# EAGLE design schematics (EAGLE 7.5.0)
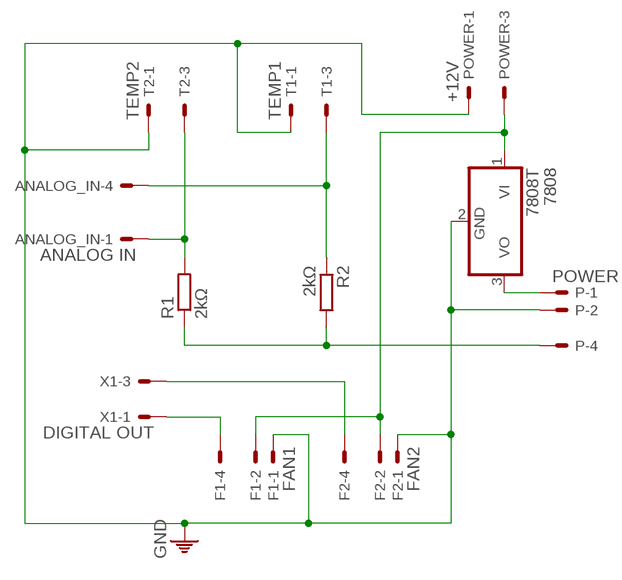
[diagram p0: schematic, sheet 1]

## Parts
7808  7808T  [TO220H]
ANALOG_IN  ANALOG IN  22-23-2041  [22-23-2041]
F1  FAN1  22-23-2041  [22-23-2041]
F2  FAN2  22-23-2041  [22-23-2041]
P  POWER  22-23-2041  [22-23-2041]
POWER  +12V  22-23-2031  [22-23-2031]
R1  2kΩ  R-EU_0411/15  [0411/15]
R2  2kΩ  R-EU_0411/15  [0411/15]
T1  TEMP1  22-23-2031  [22-23-2031]
T2  TEMP2  22-23-2031  [22-23-2031]
X1  DIGITAL OUT  22-23-2031  [22-23-2031]

## Nets
N$1: F1.4 X1.1
N$2: F2.4 X1.3
N$3: P.4 R1.1 R2.2
N$4: 7808.3(VO) P.1
N$6: 7808.1(VI) F1.2 F2.2 POWER.3
N$9: ANALOG_IN.4 R2.1 T1.3
N$10: ANALOG_IN.1 R1.2 T2.3
PE: 7808.2(GND) F1.1 F2.1 P.2 POWER.1 T1.1 T2.1 ; supply symbol labelled GND
Unconnected: ANALOG_IN.2 ANALOG_IN.3 F1.3 F2.3 P.3 POWER.2 T1.2 T2.2 X1.2

## Library data of the parts
7808 = linear:78*: Positive VOLTAGE REGULATOR Source: http://cache.national.com/ds/LM/LM78L05.pdf http://www.fairchildsemi.com/ds/LM/LM7805.pdf
ANALOG_IN F1 F2 P = con-molex:22-23-2041: .100" (2.54mm) Center Header - 4 Pin; MF: MOLEX; MPN: 22-23-2041; OC_FARNELL: 1462920; OC_NEWARK: 38C0355
POWER T1 T2 X1 = con-molex:22-23-2031: .100" (2.54mm) Center Header - 3 Pin; MF: MOLEX; MPN: 22-23-2031; OC_FARNELL: 1462950; OC_NEWARK: 30C0862
R1 R2 = resistor:R-EU_: RESISTOR, European symbol

## Board
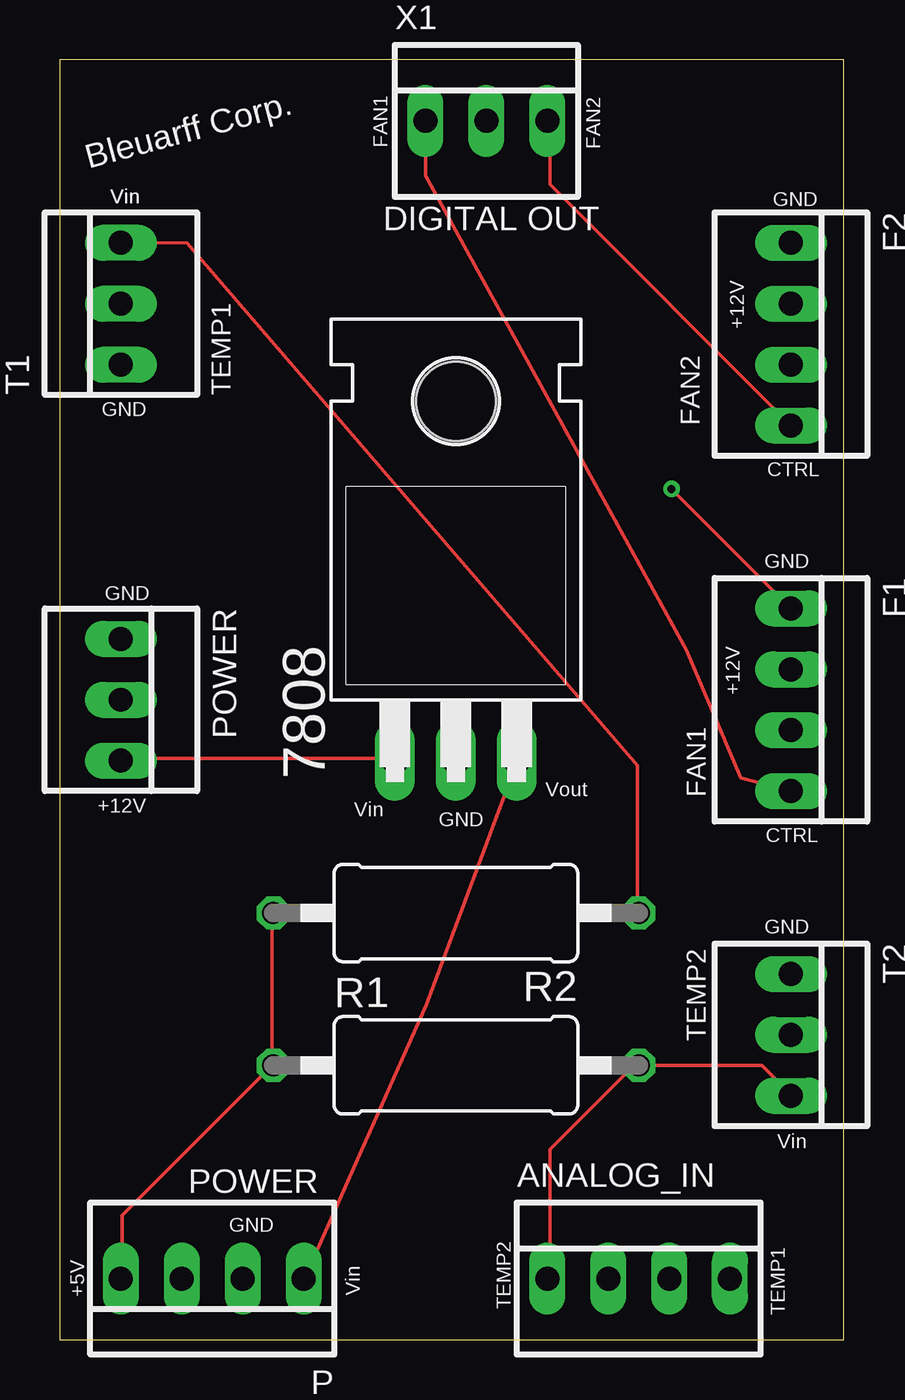
[diagram p1: board, top side]
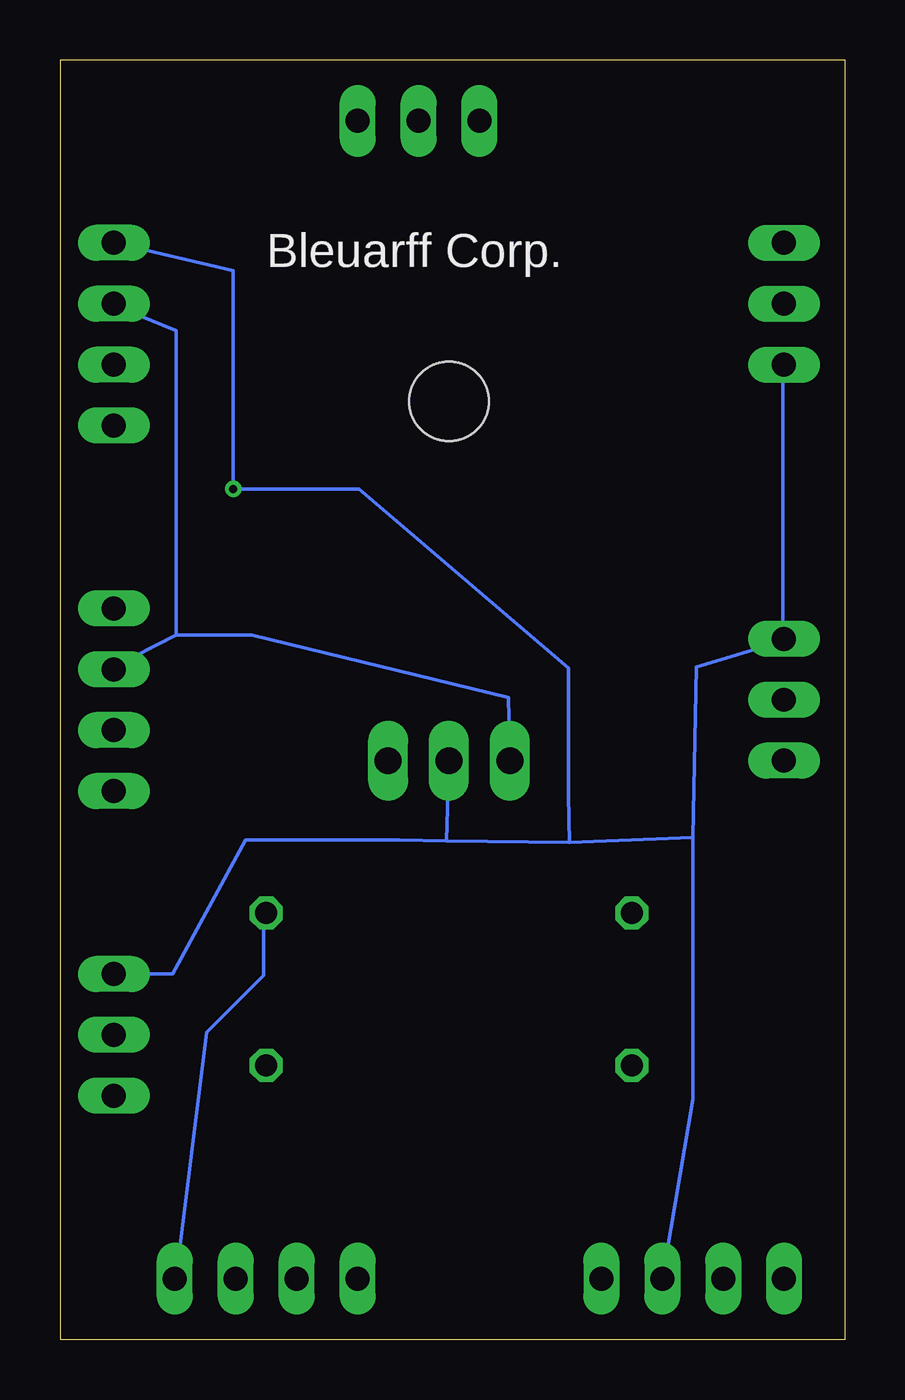
[diagram p2: board, bottom side, seen from below]

Size 32.69 x 53.34 mm. Coordinates in mm from the lower left corner, seen from the top.
Outline: 0,0 32.69,0 32.69,53.34 0,53.34 0,0
Copper layers (1*16): Top 0.0356mm / dielectric 1.5011mm / Bottom 0.0356mm
Design rules "LaenPCBOrder": minimum track width 6mil, minimum drill 13mil, track to track 6mil, track to pad 6mil, pad to pad 6mil, via to via 6mil, smd to smd 6mil, copper to edge 15mil, drill to drill 6mil, minimum pad ring 7mil, minimum via ring 7mil, stop-mask expansion 3mil, vias tented up to drill 0mil, thermal gap 10mil

### Footprints (pad centres in the part's own frame; a part is rotated, then mirrored left to right if it is on the bottom)
TO220H = drill 1.118 long: 1 -2.54,-10.16; 2 0,-10.16; 3 2.54,-10.16 | hole 3.302: 0,4.826
22-23-2041 = drill 1 long: 1 -3.81,0; 2 -1.27,0; 3 1.27,0; 4 3.81,0
22-23-2031 = drill 1 long: 1 -2.54,0; 2 0,0; 3 2.54,0
0411/15 = drill 0.914 octagon: 1 -7.62,0; 2 7.62,0

### Placement (x,y rotation side)
7808  16.51,34.29 0 top
ANALOG_IN  24.13,2.54 0 top
F1  30.48,26.67 270 top
F2  30.48,41.91 270 top
P  6.35,2.54 180 top
POWER  2.54,26.67 270 top
R1  16.51,11.43 0 top
R2  16.51,17.78 180 top
T1  2.54,43.18 90 top
T2  30.48,12.7 270 top
X1  17.78,50.8 0 top

### Tracks (layer width: path | path; a pad name or v marks a point on that pad's centre or on a via)
N$1
  Top 0.152: X1.1 15.24,48.51 26.11,28.75 28.4,23.42 F1.4
N$2
  Top 0.152: F2.4 20.42,48.16 20.42,50.75 X1.3
N$3
  Top 0.152: 8.84,11.43 8.84,17.68 R2.2 | 8.84,11.43 2.59,5.18 2.59,2.59 P.4 | 8.84,11.43 R1.1
N$4
  Top 0.152: P.1 10.21,2.59 15.29,13.97 19.05,24.08 7808.3
N$6
  Top 0.152: POWER.3 2.59,24.23 13.87,24.23 7808.1
  Bottom 0.152: 27.89,29.36 30.48,28.04 F1.2 | 27.89,29.36 27.89,42.06 30.48,43.13 F2.2 | 27.89,29.36 24.74,29.36 14.02,26.77 7808.1
N$9
  Top 0.152: T1.3 2.59,45.72 5.3,45.71 24.08,23.93 24.08,17.83 R2.1
  Bottom 0.152: R2.1 24.23,17.68 24.23,15.19 26.62,12.8 27.89,2.59 ANALOG_IN.4
N$10
  Top 0.152: T2.3 30.48,10.21 29.26,11.43 R1.2 23.93,11.43 20.42,7.92 20.42,2.59 ANALOG_IN.1
  Top 0.254: 24,11.43 R1.2
PE  (via drill 0.33)
  Top 0.152: v25.5,35.46 F1.1
  Bottom 0.152: F2.1 25.5,44.55 v25.5,35.46 20.27,35.46 11.53,27.99 11.53,22.71 11.48,20.73 | T1.1 2.59,40.54 2.59,29.26 POWER.1 2.59,29.11 6.2,28.04 6.35,20.93 | P.2 6.35,10.01 6.35,20.93 | 16.61,20.78 11.48,20.73 | 11.48,20.73 6.35,20.93 | T2.1 28.04,15.24 24.99,20.83 18.59,20.83 16.61,20.78 | 16.61,20.78 7808.2

### Text on the board
tPlace: FAN1 | FAN2 | Bleuarff Corp. | Vin | Vin | GND | DIGITAL OUT | +12V | TEMP1 | GND | FAN2 | CTRL | GND | GND | +12V | Vout | FAN1 | +12V | Vin | GND | CTRL | GND | TEMP2 | Vin | POWER | GND | +5V | Vin | TEMP2 | TEMP1
bPlace: Bleuarff Corp.